# Altium project SimpleNYT.PrjPcb
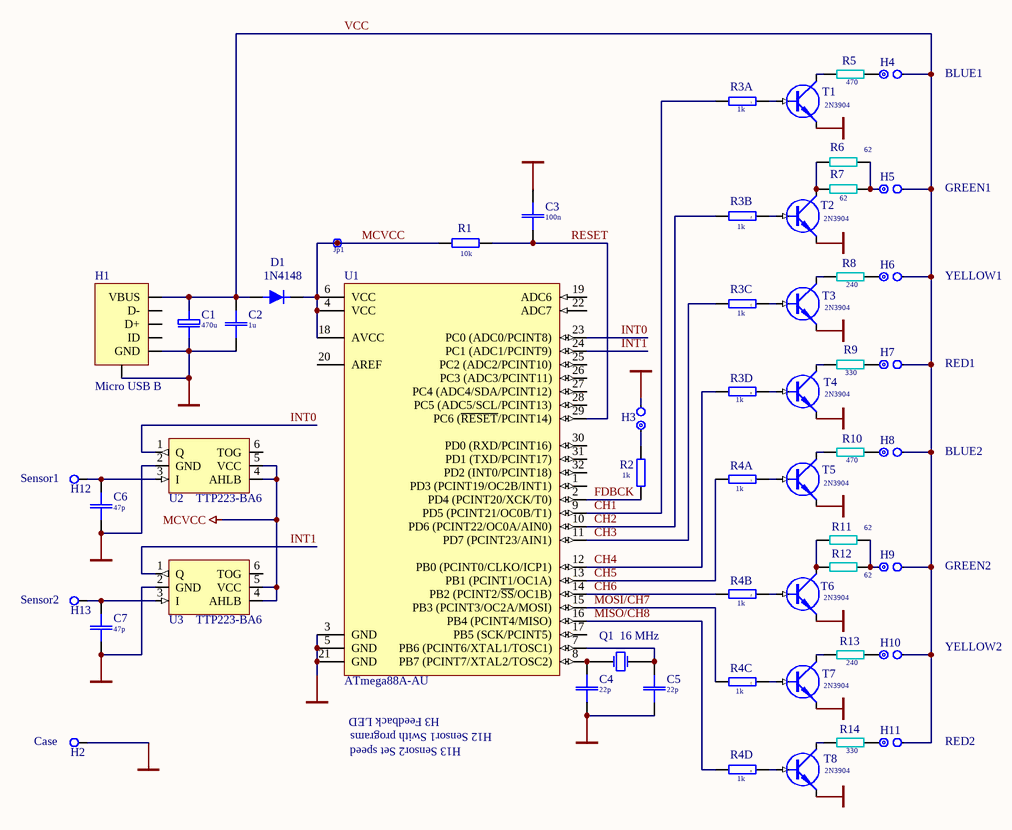
[diagram p0: SimpleNYT.SchDoc]
1 sheet, 48 parts. Net scope: global (net labels, ports and power ports of the same name join across sheets).
Board file: SimpleNYT.PcbDoc

## Sheet SimpleNYT.SchDoc: SimpleNYT
size A4; Revision: 1.0; SheetNumber: 1; SheetTotal: 1; DocumentName: SimpleNYT; ProjectName: SimpleNYT

### Parts
C1  470u  [El-d8-h12-F3.81]
C2  1u  [C0805(2013)]
C3  100n  [C0805(2013)]
C4  22p  [C0805(2013)]
C5  22p  [C0805(2013)]
C6  47p  [C0805(2013)]
C7  47p  [C0805(2013)]
D1  1N4148  [SOD323]
H1  Micro USB B  [DX4R005H91]
H2  H-1  [J1]  (value not drawn)
H3  H-1x2  [J1x2]  (value not drawn)
H4  H-1x2  [J1x2]  (value not drawn)
H5  H-1x2  [J1x2]  (value not drawn)
H6  H-1x2  [J1x2]  (value not drawn)
H7  H-1x2  [J1x2]  (value not drawn)
H8  H-1x2  [J1x2]  (value not drawn)
H9  H-1x2  [J1x2]  (value not drawn)
H10  H-1x2  [J1x2]  (value not drawn)
H11  H-1x2  [J1x2]  (value not drawn)
H12  H-1  [J1]  (value not drawn)
H13  H-1  [J1]  (value not drawn)
Jp1  0  [J-1206]  (value not drawn)
Q1  16 MHz  [HC49/4H_SMX]
R1  10k  [R0805]
R2  1k  [R0805]
R3  1k  [RM4x0603]  (parts A,B,C,D of 4)
R4  1k  [RM4x0603]  (parts A,B,C,D of 4)
R5  470  [R1206]
R6  62  [R1206]
R7  62  [R1206]
R8  240  [R1206]
R9  330  [R1206]
R10  470  [R1206]
R11  62  [R1206]
R12  62  [R1206]
R13  240  [R1206]
R14  330  [R1206]
T1  2N3904  [SOT23]
T2  2N3904  [SOT23]
T3  2N3904  [SOT23]
T4  2N3904  [SOT23]
T5  2N3904  [SOT23]
T6  2N3904  [SOT23]
T7  2N3904  [SOT23]
T8  2N3904  [SOT23]
U1  ATmega88A-AU  [32A_N]
U2  TTP223-BA6  [SOT23-6]
U3  TTP223-BA6  [SOT23-6]

### Nets
GND: C1.2 C2.2 C3.1 C4.2 C5.2 C6.2 C7.2 H1.5(GND) H1.6(CASE) H2.1 H3.2 T1.2(E) T2.2(E) T3.2(E) T4.2(E) T5.2(E) T6.2(E) T7.2(E) T8.2(E) U1.3(GND) U1.5(GND) U1.21(GND) U2.2(GND) U3.2(GND)
MCVCC: D1.2(C) Jp1.1(A) Jp1.2(B) R1.2 U1.4(VCC) U1.6(VCC) U1.18(AVCC) U2.4(AHLB) U2.5(VCC) U3.4(AHLB) U3.5(VCC)
CH1: R3.8 U1.9(PD5_(PCINT21/OC0B/T1))
CH2: R3.7 U1.10(PD6_(PCINT22/OC0A/AIN0))
CH3: R3.6 U1.11(PD7_(PCINT23/AIN1))
CH4: R3.5 U1.12(PB0_(PCINT0/CLKO/ICP1))
CH5: R4.8 U1.13(PB1_(PCINT1/OC1A))
CH6: R4.7 U1.14(PB2_(PCINT2/~{SS}/OC1B))
FDBCK: R2.2 U1.2(PD4_(PCINT20/XCK/T0))
INT0: U1.23(PC0_(ADC0/PCINT8)) U2.1(Q)
INT1: U1.24(PC1_(ADC1/PCINT9)) U3.1(Q)
MISO/CH8: R4.5 U1.16(PB4_(PCINT4/MISO))
MOSI/CH7: R4.6 U1.15(PB3_(PCINT3/OC2A/MOSI))
RESET: C3.2 R1.1 U1.29(PC6_(~{RESET}/PCINT14))
VCC: C1.1 C2.1 D1.1(A) H1.1(VBUS) H4.2 H5.2 H6.2 H7.2 H8.2 H9.2 H10.2 H11.2
NetC4_1: C4.1 Q1.1(OSC1) U1.8(PB7_(PCINT7/XTAL2/TOSC2))
NetC5_1: C5.1 Q1.2(OSC2) U1.7(PB6_(PCINT6/XTAL1/TOSC1))
NetC6_1: C6.1 H12.1 U2.3(I)
NetC7_1: C7.1 H13.1 U3.3(I)
NetH3_1: H3.1 R2.1
NetH4_1: H4.1 R5.1
NetH5_1: H5.1 R6.1 R7.1
NetH6_1: H6.1 R8.1
NetH7_1: H7.1 R9.1
NetH8_1: H8.1 R10.1
NetH9_1: H9.1 R11.1 R12.1
NetH10_1: H10.1 R13.1
NetH11_1: H11.1 R14.1
NetR3_1: R3.1 T1.1(B)
NetR3_2: R3.2 T2.1(B)
NetR3_3: R3.3 T3.1(B)
NetR3_4: R3.4 T4.1(B)
NetR4_1: R4.1 T5.1(B)
NetR4_2: R4.2 T6.1(B)
NetR4_3: R4.3 T7.1(B)
NetR4_4: R4.4 T8.1(B)
NetR5_2: R5.2 T1.3(C)
NetR6_2: R6.2 R7.2 T2.3(C)
NetR8_2: R8.2 T3.3(C)
NetR9_2: R9.2 T4.3(C)
NetR10_2: R10.2 T5.3(C)
NetR11_2: R11.2 R12.2 T6.3(C)
NetR13_2: R13.2 T7.3(C)
NetR14_2: R14.2 T8.3(C)

Not connected (* = marked no-connect by the designer): H1 2(D-) 3(D+) 4(ID); U1 1(PD3_(PCINT19/OC2B/INT1)) 17(PB5_(SCK/PCINT5)) 19(ADC6) 20(AREF) 22(ADC7) 25(PC2_(ADC2/PCINT10)) 26(PC3_(ADC3/PCINT11)) 27(PC4_(ADC4/SDA/PCINT12)) 28(PC5_(ADC5/SCL/PCINT13)) 30(PD0_(RXD/PCINT16)) 31(PD1_(TXD/PCINT17)) 32(PD2_(INT0/PCINT18)); U2 6(TOG); U3 6(TOG)

### Notes on the sheet
- (near H4) BLUE1
- (near H5) GREEN1
- (near H6) YELLOW1
- (near H7) RED1
- (near H12) Sensor1
- (near H8) BLUE2
- (near H9) GREEN2
- (near H13) Sensor2
- (near U1) H3 Feedback LED
- (near H10) YELLOW2
- (near H2) Case
- H13 Sensor2 Set speed
- H12 Sensor1 Swith programs
- (near H11) RED2
- Title
- Size:
- Date:
- A4
- Number:
- Time:
- Revision:
- Sheet
- of
- File:

### Library data of the parts
C1 = 470u-16V: 16V; Price: 0.1; Value: 470u
C2-C7 = C-0805: SMD-0805; Price: 0.014
  C2: Value: 1u
  C3: Value: 100n
  C4 C5: Value: 22p
  C6 C7: Value: 47p
D1 = 1N4148: DO-35 75V 0.2A 1uS 4A 4nS; Price: 0.02
H1 = Micro USB B: DX4R005H91
Jp1 = Jp-1206: SMD-1206-om; Price: 0.045
Q1 = HC49/4H_SMX: Surface Mount Quartz Crystal; Note: PCB layout complies with manufacturer's recommendation.; Published: 17-Jul-2002; DatasheetDocument: 18-Oct-1999; PackageDocument: 18-Oct-1999; PackageReference: HC49/4H_SMX; Publisher: Altium Limited; ComponentLink1Description: Manufacturer Link; ComponentLink1URL: http://www.cmac.com/mt/; ComponentLink2Description: Datasheet; ComponentLink2URL: http://www.cmac.com/mt/databook/crystals/smd/hc49_4h_smx.pdf; Freq: 16 MHz
R1 R2 = R-0805: SMD 0805 0.1W 5% 150V; Price: 0.017
  R1: Value: 10k
  R2: Value: 1k
R3 R4 = 4RM-0603: SMD 4RM-0603 1\16W 5%; Price: 0.07; Value: 1k
R5-R14 = R-1206: SMD 1206 0.125W 5% 200V; Price: 0.045
  R5 R10: Value: 470
  R6 R7 R11 R12: Value: 62
  R8 R13: Value: 240
  R9 R14: Value: 330
T1-T8 = BC847C: SMD-SOT23; Price: 0.04
U1 = ATmega88A-AU: 8-bit AVR Microcontroller, 8KB Flash, 512 Bytes EEPROM, 1KB SRAM, 32-pin TQFP, Industrial Grade (-40°C to 85°C); DatasheetVersion: revD, May-2011; PackageVersion: revC, Oct-2010; PackageReference: 32A; PackageDescription: 32-Lead, 7x7x1.0 mm Body, 0.8mm Lead Pitch, Thin Profile Plastic Quad Flat Package (TQFP); Code_JEDEC: MS-026-ABA; ComponentLink1Description: Manufacturer URL; ComponentLink1URL: http://www.atmel.com/; ComponentLink2Description: ATmega48A/48PA/88A/88PA/168A/168PA/328/328P Datasheet; ComponentLink2URL: http://www.atmel.com/dyn/resources/prod_documents/doc8271.pdf; ComponentLink3Description: ATmega48A/48PA/88A/88PA/168A/168PA/328/328P Summary; ComponentLink3URL: http://www.atmel.com/dyn/resources/prod_documents/8271S.pdf
U2 U3 = TTP223-BA6: Touch pad detector IC; Name: TTP223-BA6
H2 H12 H13 = H-1: Price: 0.01
H3-H11 = H-1x2: Price: 0.02